# EAGLE design zigduino-mini-3 (EAGLE 5.10)
BOM: EXCLUDE; COLOR: GREEN; DNP: T; PARTNO: S-35390A-I8T1G
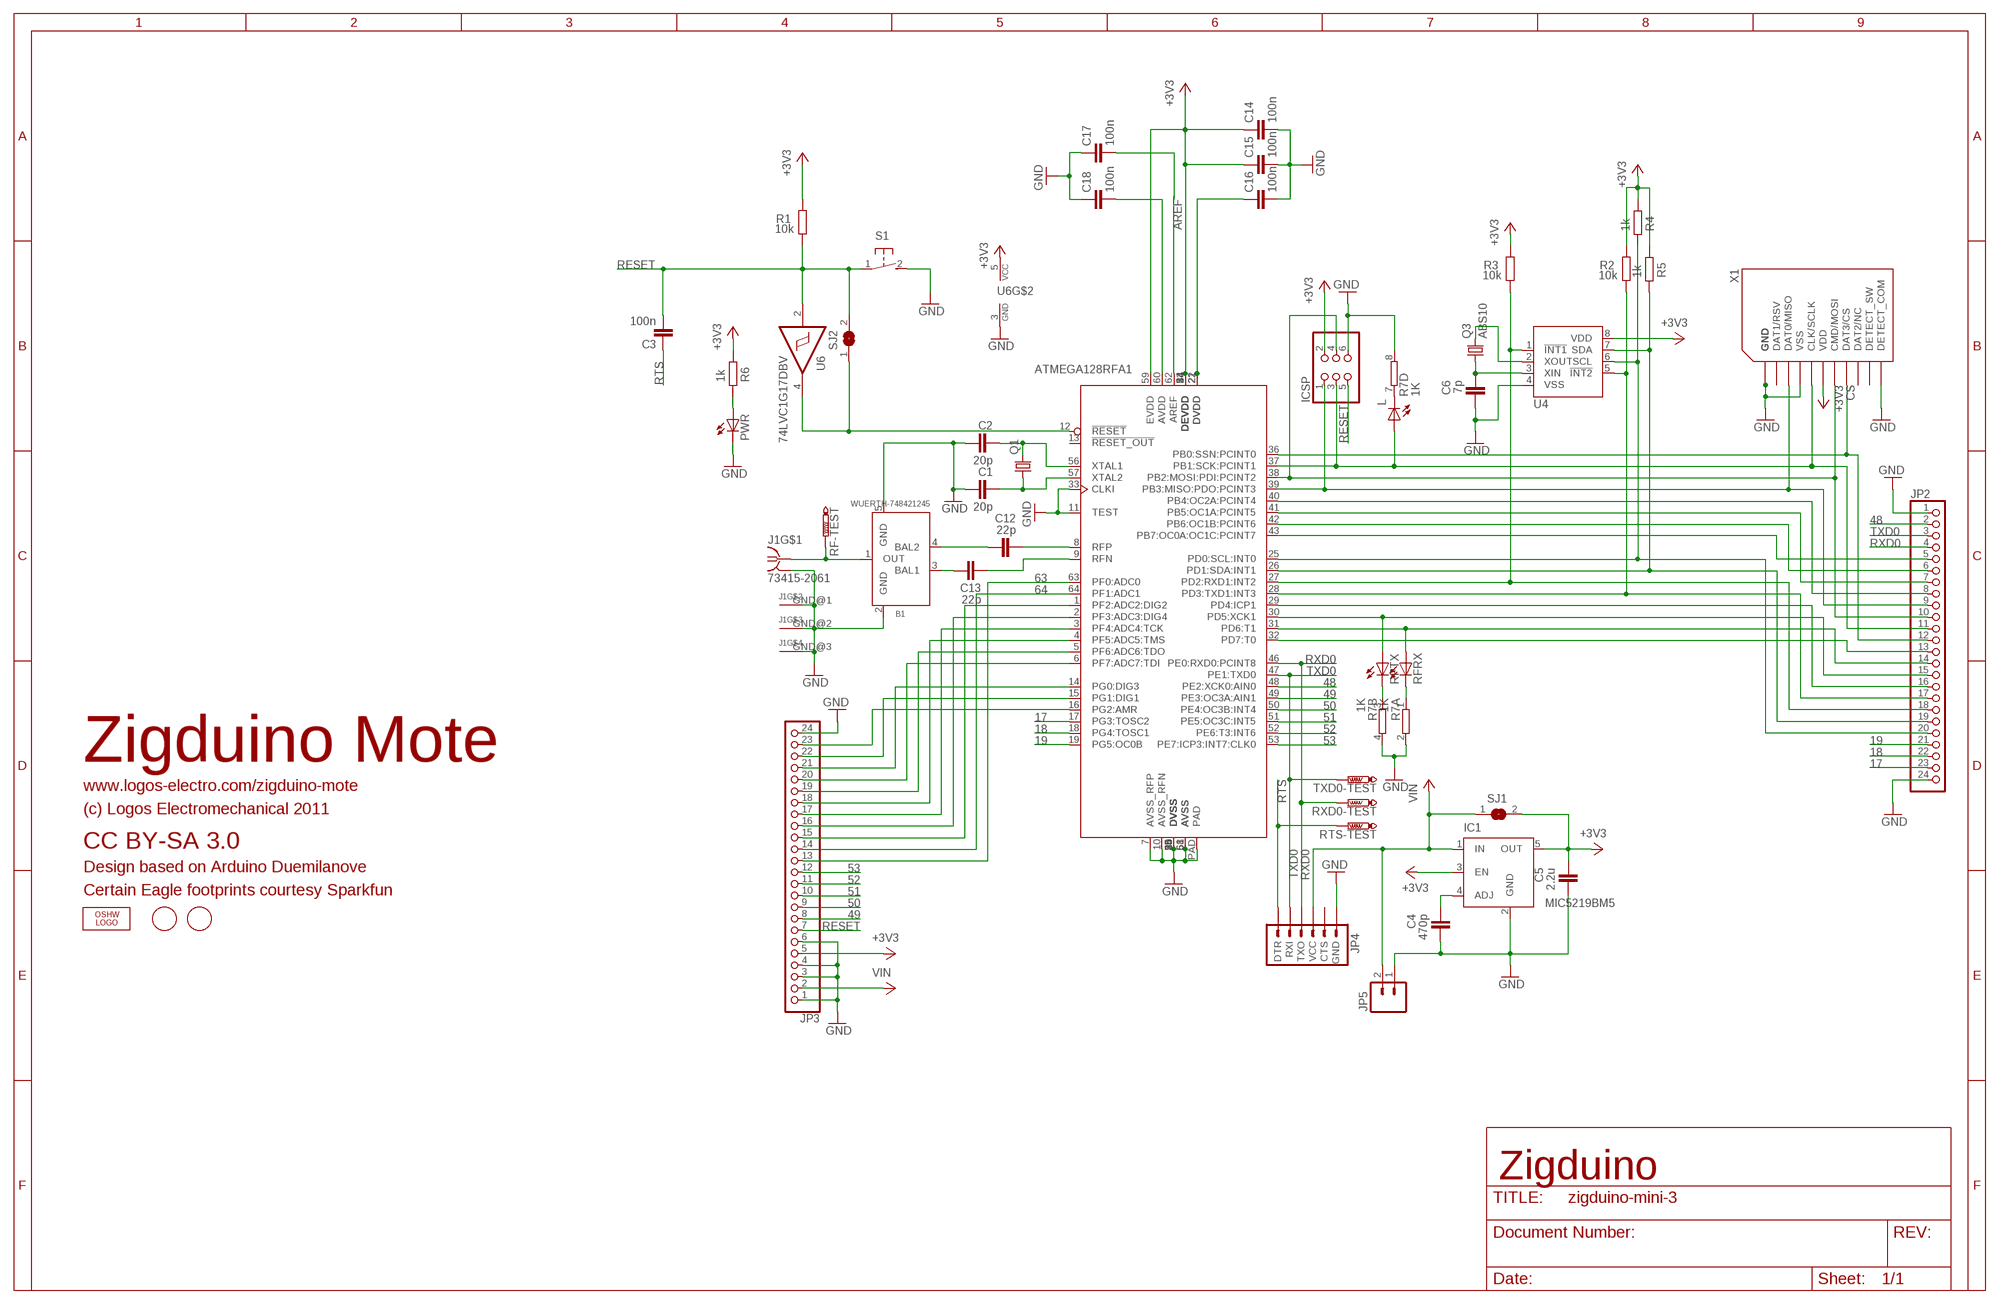
[diagram p0: schematic, sheet 1]

## Parts
B1  WUERTH-748421245  [WURTH-BALUN]
C1  20p  C-EUC0603  [C0603]
C2  20p  C-EUC0603  [C0603]
C3  100n  C-EUC0603  [C0603]
C4  470p  C-EUC0603  [C0603]
C5  2.2u  C-EUC0603  [C0603]
C6  7p  C-EUC0603  [C0603]
C12  22p  C-EUC0603  [C0603]
C13  22p  C-EUC0603  [C0603]
C14  100n  C-EUC0603  [C0603]
C15  100n  C-EUC0603  [C0603]
C16  100n  C-EUC0603  [C0603]
C17  100n  C-EUC0603  [C0603]
C18  100n  C-EUC0603  [C0603]
IC1  MIC5219BM5  [SOT23-5]
ICSP  PINHD-2X3_2.54-SMD  [2X03SMD]
J1  73415-2061  [MMCX]
JP2  PINHD-1X24  [1X24]
JP3  PINHD-1X24  [1X24]
JP4  ARDUINO_SERIAL_PROGRAMSMD  [1X06-SMD]
JP5  M02-JST-2MM-SMT  [S2B-PH]
L  LEDCHIP-LED0603  [CHIP-LED0603]
LOGO1  OSHW_LOGO_FILLX0200-NT  [OSHW_FILLX200_NOTEXT]
PWR  LEDCHIP-LED0603  [CHIP-LED0603]
Q1  CRYSTALCSM-3X  [CSM-3X]
Q3  ABS10  [ABS10]
R1  10k  R-EU_R0603  [R0603]
R2  10k  R-EU_R0603  [R0603]
R3  10k  R-EU_R0603  [R0603]
R4  1k  R-EU_R0603  [R0603]
R5  1k  R-EU_R0603  [R0603]
R6  1k  R-EU_R0603  [R0603]
R7  1K  4R-NCTS742C083  [CTS742C083-RES]
RF-TEST  PTR1TP13SQ  [TP13SQ]
RFRX  LEDCHIP-LED0603  [CHIP-LED0603]
RFTX  LEDCHIP-LED0603  [CHIP-LED0603]
RTS-TEST  PTR1TP13SQ  [TP13SQ]
RXD0-TEST  PTR1TP13SQ  [TP13SQ]
S1  B3U-1000  [B3U]
SJ1  SJ  [SJ]
SJ2  SJ  [SJ]
TXD0-TEST  PTR1TP13SQ  [TP13SQ]
U3  ATMEGA128RFA1  [QFN64]
U4  S35390A-I8T1  [SNT-8A]
U6  74LVC1G17DBV  [SOT23-5]
U$1  FIDUCIAL  [FIDUCIAL_1MM]
U$2  FIDUCIAL  [FIDUCIAL_1MM]
X1  MICROSD-MOLEX-502570  [MOLEX-MICRO-SD-502570]

## Nets
17: JP2.23 U3.17(PG3:TOSC2)
18: JP2.22 U3.18(PG4:TOSC1)
19: JP2.21 U3.19(PG5:OC0B)
48: JP2.2 U3.48(PE2:XCK0:AIN0)
49: JP3.8 U3.49(PE3:OC3A:AIN1)
50: JP3.9 U3.50(PE4:OC3B:INT4)
51: JP3.10 U3.51(PE5:OC3C:INT5)
52: JP3.11 U3.52(PE6:T3:INT6)
53: JP3.12 U3.53(PE7:ICP3:INT7:CLK0)
63: JP3.13 U3.63(PF0:ADC0)
64: JP3.14 U3.64(PF1:ADC1)
+3V3: C5.2 C14.1 C15.1 IC1.3(EN) IC1.5(OUT) ICSP.2 JP3.5 R1.2 R2.2 R3.2 R4.1 R5.1 R6.1 SJ1.2 U3.23(DEVDD) U3.34(DEVDD) U3.44(DEVDD) U3.54(DEVDD) U3.59(EVDD) U4.8(VDD) U6.5(VCC) X1.4(VDD)
+5V: IC1.1(IN) JP3.2 JP4.4(VCC) JP5.2 SJ1.1 ; supply symbol labelled VIN
AREF [aref]: C17.2 U3.62(AREF)
CS: JP2.12 U3.36(PB0:SSN:PCINT0) X1.2(DAT3/CS)
GND [gnd]: B1.2(GND) B1.5(GND) C1.1 C2.1 C4.1 C5.1 C6.1 C14.2 C15.2 C16.2 C17.1 C18.1 IC1.2(GND) ICSP.6 J1.GND@0(GND) J1.GND@1(PIN) J1.GND@2(PIN) J1.GND@3(PIN) JP2.1 JP2.24 JP3.1 JP3.3 JP3.4 JP3.6 JP3.24 JP4.6(GND) JP5.1 PWR.C R7.2 R7.4 R7.8 S1.2 U3.7(AVSS_RFP) U3.10(AVSS_RFN) U3.11(TEST) U3.20(DVSS) U3.24(DVSS) U3.33(CLKI) U3.35(DVSS) U3.45(DVSS) U3.55(DVSS) U3.58(AVSS) U3.61(AVSS) U3.PAD U4.4(VSS) U6.3(GND) X1.6(VSS) X1.DETECT_GND(DETECT_COM) X1.GND@0(GND) X1.GND@1(GND) X1.GND@2(GND) X1.GND@3(GND)
MISO: ICSP.1 JP2.9 U3.39(PB3:MISO:PDO:PCINT3) X1.7(DAT0/MISO)
MOSI: ICSP.4 JP2.10 U3.38(PB2:MOSI:PDI:PCINT2) X1.3(CMD/MOSI)
N$1: C4.2 IC1.4(ADJ)
N$2: L.C R7.7
N$3: PWR.A R6.2
N$4 [rf]: B1.4(BAL2) C12.1
N$6: C1.2 Q1.1 U3.57(XTAL2)
N$7: C2.2 Q1.2 U3.56(XTAL1)
N$8: JP2.8 U3.40(PB4:OC2A:PCINT4)
N$9 [rf]: B1.3(BAL1) C13.1
N$10: JP2.7 U3.41(PB5:OC1A:PCINT5)
N$11: JP2.6 U3.42(PB6:OC1B:PCINT6)
N$12: JP2.5 U3.43(PB7:OC0A:OC1C:PCINT7)
N$13: JP2.20 R4.2 U3.25(PD0:SCL:INT0) U4.6(SCL)
N$14: JP2.19 R5.2 U3.26(PD1:SDA:INT1) U4.7(SDA)
N$15: JP2.18 R3.1 U3.27(PD2:RXD1:INT2) U4.1(!INT1!)
N$16: JP2.17 R2.1 U3.28(PD3:TXD1:INT3) U4.5(!INT2!)
N$17: JP2.16 U3.29(PD4:ICP1)
N$18 [gnd]: B1.1(OUT) J1.C RF-TEST.TP
N$19: JP2.15 RFTX.A U3.30(PD5:XCK1)
N$20: JP2.14 RFRX.A U3.31(PD6:T1)
N$21: JP2.13 U3.32(PD7:T0)
N$22: JP3.23 U3.16(PG2:AMR)
N$23 [rf]: C12.2 U3.8(RFP)
N$24 [rf]: C13.2 U3.9(RFN)
N$25: JP3.22 U3.15(PG1:DIG1)
N$26: JP3.21 U3.14(PG0:DIG3)
N$27: JP3.20 U3.6(PF7:ADC7:TDI)
N$28: JP3.19 U3.5(PF6:ADC6:TDO)
N$29: SJ2.1 U3.12(!RESET!) U6.4(O)
N$30: JP3.18 U3.4(PF5:ADC5:TMS)
N$31: JP3.17 U3.3(PF4:ADC4:TCK)
N$32: JP3.16 U3.2(PF3:ADC3:DIG4)
N$33: JP3.15 U3.1(PF2:ADC2:DIG2)
N$34: R7.3 RFTX.C
N$35: R7.1 RFRX.C
N$36: C6.2 Q3.1 U4.3(XIN)
N$37: Q3.2 U4.2(XOUT)
N$63: C16.1 U3.21(DVDD) U3.22(DVDD)
N$64: C18.2 U3.60(AVDD)
RESET: C3.2 ICSP.5 JP3.7 R1.1 S1.1 SJ2.2 U6.2(I)
RTS: C3.1 JP4.1(DTR) RTS-TEST.TP
RXD0: JP2.4 JP4.3(TXO) RXD0-TEST.TP U3.46(PE0:RXD0:PCINT8)
SCK: ICSP.3 JP2.11 L.A U3.37(PB1:SCK:PCINT1) X1.5(CLK/SCLK)
TXD0: JP2.3 JP4.2(RXI) TXD0-TEST.TP U3.47(PE1:TXD0)
Unconnected: JP4.5(CTS) R7.5 R7.6 U3.13(!RESET_OUT!) X1.1(DAT2/NC) X1.8(DAT1/RSV) X1.DETECT_SW

## Notes on the sheet
- ATMEGA128RFA1
- Zigduino Mote
- www.logos-electro.com/zigduino-mote
- (c) Logos Electromechanical 2011
- CC BY-SA 3.0
- Design based on Arduino Duemilanove
- Certain Eagle footprints courtesy Sparkfun
- Zigduino

## Library data of the parts
B1 = atmega128rfa1:WUERTH-748421245: Recommended Balun for Atmega128RFA1
C1-C6 C12-C18 = resistor:C-EU: CAPACITOR, European symbol
IC1 = v-reg-micrel:MIC5219BM5: VOLTAGE REGULATOR
ICSP = pinhead-1:PINHD-2X3: PIN HEADER
J1 = atmega128rfa1:73415-2061: Molex 73415-2061
JP2 JP3 = pinhead:PINHD-1X24: PIN HEADER
JP4 = SparkFun:ARDUINO_SERIAL_PROGRAM
JP5 = SparkFun:M02: Header 2 Standard 2-pin 0.1" header. Use with straight break away headers (SKU : PRT-00116), right angle break away headers (PRT-00553), swiss pins (PRT-00743), machine pins (PRT-00117), and female headers (PRT-00115). Molex polarized connector foot print use with SKU : PRT-08233 with associated crimp pins and housings.
L PWR RFRX RFTX = led:LED: LED OSRAM: - CHIPLED LG R971, LG N971, LY N971, LG Q971, LY Q971, LO R971, LY R971 LH N974, LH R974 LS Q976, LO Q976, LY Q976 LO Q996 - Hyper CHIPLED LW Q18S LB Q993, LB Q99A, LB R99A - SideLED LS A670, LO A670, LY A670, LG A670, LP A670 LB A673, LV A673, LT A673, LW A673 LH A674 LY A675 LS A676, LA A676, LO A676, LY A676, LW A676 LS A679, LY A679, LG A679 - Hyper Micro SIDELED® LS Y876, LA Y876, LO Y876, LY Y876 LT Y87S - SmartLED LW L88C, LW L88S LB L89C, LB L89S, LG L890 LS L89K, LO L89K, LY L89K LS L896, LA L896, LO L896, LY L896 - TOPLED LS T670, LO T670, LY T670, LG T670, LP T670 LSG T670, LSP T670, LSY T670, LOP T670, LYG T670 LG T671, LOG T671, LSG T671 LB T673, LV T673, LT T673, LW T673 LH T674 LS T676, LA T676, LO T676, LY T676, LB T676, LH T676, LSB T676, LW T676 LB T67C, LV T67C, LT T67C, LS T67K, LO T67K, LY T67K, LW E67C LS E67B, LA E67B, LO E67B, LY E67B, LB E67C, LV E67C, LT E67C LW T67C LS T679, LY T679, LG T679 LS T770, LO T770, LY T770, LG T770, LP T770 LB T773, LV T773, LT T773, LW T773 LH T774 LS E675, LA E675, LY E675, LS T675 LS T776, LA T776, LO T776, LY T776, LB T776 LHGB T686 LT T68C, LB T68C - Hyper Mini TOPLED® LB M676 - Mini TOPLED Santana® LG M470 LS M47K, LO M47K, LY M47K Source: http://www.osram.convergy.de LUXEON: - LUMILED® LXK2-PW12-R00, LXK2-PW12-S00, LXK2-PW14-U00, LXK2-PW14-V00 LXK2-PM12-R00, LXK2-PM12-S00, LXK2-PM14-U00 LXK2-PE12-Q00, LXK2-PE12-R00, LXK2-PE12-S00, LXK2-PE14-T00, LXK2-PE14-U00 LXK2-PB12-K00, LXK2-PB12-L00, LXK2-PB12-M00, LXK2-PB14-N00, LXK2-PB14-P00, LXK2-PB14-Q00 LXK2-PR12-L00, LXK2-PR12-M00, LXK2-PR14-Q00, LXK2-PR14-R00 LXK2-PD12-Q00, LXK2-PD12-R00, LXK2-PD12-S00 LXK2-PH12-R00, LXK2-PH12-S00 LXK2-PL12-P00, LXK2-PL12-Q00, LXK2-PL12-R00 Source: www.luxeon.com KINGBRIGHT: KA-3528ASYC Source: www.kingbright.com
LOGO1 = OSHW:OSHW_LOGO_FILL
Q1 = logos-crystals:CRYSTAL: CRYSTAL
Q3 = logos-crystals:ABS10
R1-R6 = resistor:R-EU_: RESISTOR, European symbol
R7 = res-cap-arrays:4R-N: Array Chip Resistor Source: RS Component / Phycomp
RF-TEST RTS-TEST RXD0-TEST TXD0-TEST = testpad:PTR1: TEST PIN
S1 = logos-faves:B3U-1000: Omron B3U-1000 SMD tact switch
SJ1 SJ2 = jumper:SJ: SMD solder JUMPER
U3 = atmega128rfa1:ATMEGA128RFA1: Atmega128RFA1 -- Atmega128 with Zigbee
U4 = logos-rtc:S35390A: S-35390A 2-Wire RTC
U6 = 74xx-little-us:74*1G17: Single Schmitt-Trigger Buffer
U$1 U$2 = adafruit:FIDUCIAL: For use by pick and place machines to calibrate the vision/machine, 1mm By microbuilder.eu
X1 = logos-faves:MICROSD-MOLEX-502570

## Net classes
1 power: width 0.254 mm, drill 0.381 mm
2 gnd: width 0.254 mm, drill 0.381 mm
3 usbvcc: width 0.305 mm, drill 0.381 mm
4 aref: width 0.305 mm
5 rf: width 0.254 mm

## Board
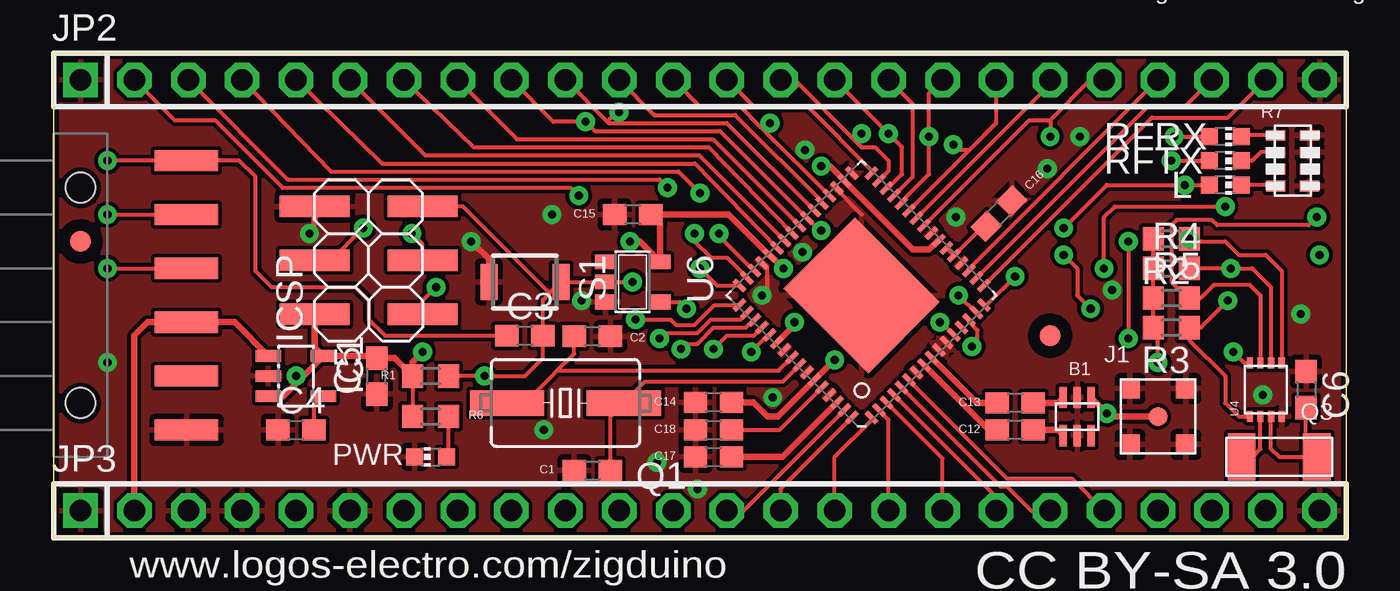
[diagram p1: board, top side]
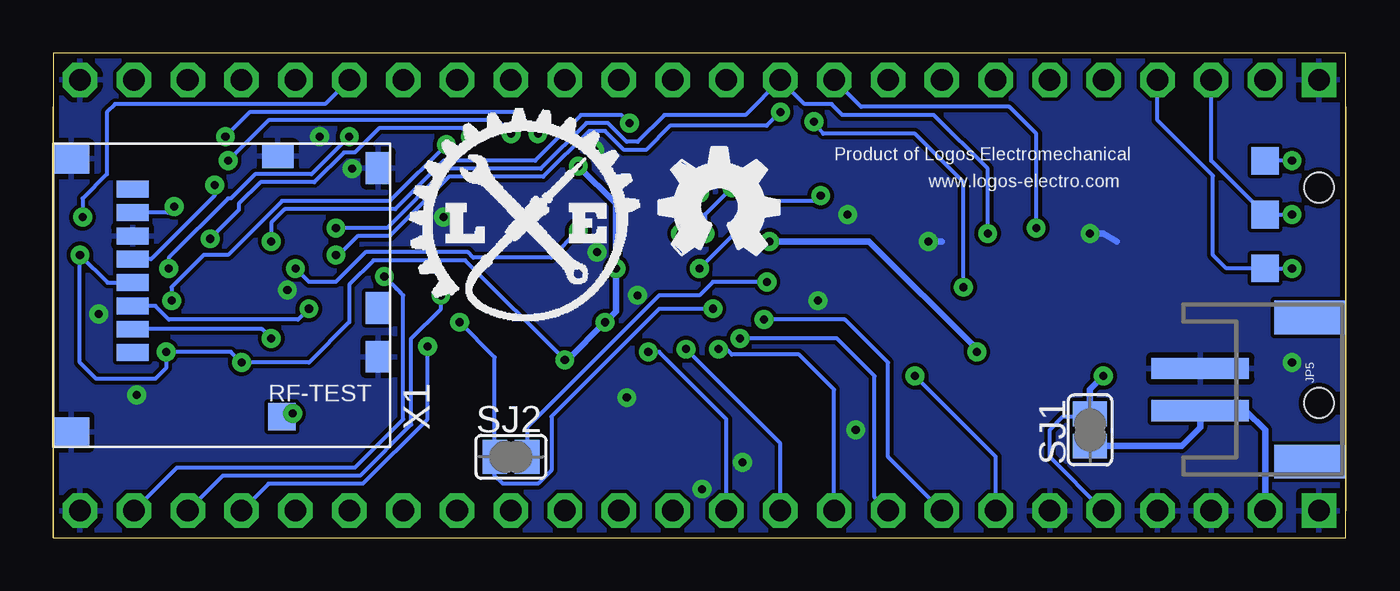
[diagram p2: board, bottom side, seen from below]

Size 60.96 x 22.86 mm. Coordinates in mm from the lower left corner, seen from the top.
Outline: 0,22.86 60.96,22.86 60.96,0 0,0 0,22.86
Copper layers (1*16): Top 0.0356mm / dielectric 1.5011mm / Bottom 0.0356mm
Design rules "hbl-panel-7mil *": minimum track width 7mil, minimum drill 15mil, track to track 7mil, track to pad 7mil, pad to pad 7mil, via to via 7mil, smd to smd 0mil, copper to edge 10mil, drill to drill 8mil, minimum pad ring 12mil, minimum via ring 10mil, stop-mask expansion 0mil, vias tented up to drill 50mil, thermal gap 10mil
Milling: 2 lines

### Footprints (pad centres in the part's own frame; a part is rotated, then mirrored left to right if it is on the bottom)
WURTH-BALUN = smd 0.35 x 1: 1 0.65,0.9; 2 0,0.9; 3 -0.65,0.9; 4 -0.65,-0.9; 5 0,-0.9; 6 0.65,-0.9
C0603 = smd 1.1 x 1: 1 -0.85,0; 2 0.85,0
SOT23-5 = smd 0.55 x 1.2: 1 -0.95,-1.3; 2 0,-1.3; 3 0.95,-1.3; 4 0.95,1.3; 5 -0.95,1.3
2X03SMD = smd 1.016 x 3.302: 1 -1.27,-3.81; 2 -1.27,1.27; 3 1.27,-3.81; 4 1.27,1.27; 5 3.81,-3.81; 6 3.81,1.27
MMCX = smd 0.89 x 0.89: C 0,0 | smd 0.94 x 0.94: GND@0 -1.32,1.32; GND@1 1.32,1.32; GND@2 -1.32,-1.32; GND@3 1.32,-1.32
1X24 = drill 1.016 square: 1 -29.21,0 | drill 1.016 octagon: 2 -26.67,0; 3 -24.13,0; 4 -21.59,0; 5 -19.05,0; 6 -16.51,0; 7 -13.97,0; 8 -11.43,0; 9 -8.89,0; 10 -6.35,0; 11 -3.81,0; 12 -1.27,0; 13 1.27,0; 14 3.81,0; 15 6.35,0; 16 8.89,0; 17 11.43,0; 18 13.97,0; 19 16.51,0; 20 19.05,0; 21 21.59,0; 22 24.13,0; 23 26.67,0; 24 29.21,0
1X06-SMD = smd 1 x 3: 1 -6.35,5; 2 -3.81,5; 3 -1.27,5; 4 1.27,5; 5 3.81,5; 6 6.35,5 | hole 1.4: -5.08,0; 5.08,0
S2B-PH = smd 1 x 4.6: 1 -1,-3.7; 2 1,-3.7 | smd 1.6 x 3.4: NC1 -3.4,1.5; NC2 3.4,1.5
CHIP-LED0603 = smd 0.8 x 0.8: A 0,-0.75; C 0,0.75
CSM-3X = smd 3.5 x 1.2: 1 -2.75,0; 2 2.75,0
ABS10 = smd 1.3 x 2.2: 1 1.775,0; 2 -1.775,0
R0603 = smd 1 x 1.1: 1 -0.85,0; 2 0.85,0
CTS742C083-RES = smd 0.9 x 0.5: 1 -0.8,1.2; 2 0.8,1.2; 3 -0.8,0.4; 4 0.8,0.4; 5 -0.8,-0.4; 6 0.8,-0.4; 7 -0.8,-1.2; 8 0.8,-1.2
TP13SQ = smd 1.3 x 1.3: TP 0,0
B3U = smd 0.8 x 1.7: 1 -1.7,0; 2 1.7,0
SJ = smd 1.168 x 1.6: 1 -0.762,0; 2 0.762,0
QFN64 = smd 0.7 x 0.25: 1 -4.4,3.75; 2 -4.4,3.25; 3 -4.4,2.75; 4 -4.4,2.25; 5 -4.4,1.75; 6 -4.4,1.25; 7 -4.4,0.75; 8 -4.4,0.25; 9 -4.4,-0.25; 10 -4.4,-0.75; 11 -4.4,-1.25; 12 -4.4,-1.75; 13 -4.4,-2.25; 14 -4.4,-2.75; 15 -4.4,-3.25; 16 -4.4,-3.75; 33 4.4,-3.75; 34 4.4,-3.25; 35 4.4,-2.75; 36 4.4,-2.25; 37 4.4,-1.75; 38 4.4,-1.25; 39 4.4,-0.75; 40 4.4,-0.25; 41 4.4,0.25; 42 4.4,0.75; 43 4.4,1.25; 44 4.4,1.75; 45 4.4,2.25; 46 4.4,2.75; 47 4.4,3.25; 48 4.4,3.75 | smd 0.25 x 0.7: 17 -3.75,-4.4; 18 -3.25,-4.4; 19 -2.75,-4.4; 20 -2.25,-4.4; 21 -1.75,-4.4; 22 -1.25,-4.4; 23 -0.75,-4.4; 24 -0.25,-4.4; 25 0.25,-4.4; 26 0.75,-4.4; 27 1.25,-4.4; 28 1.75,-4.4; 29 2.25,-4.4; 30 2.75,-4.4; 31 3.25,-4.4; 32 3.75,-4.4; 49 3.75,4.4; 50 3.25,4.4; 51 2.75,4.4; 52 2.25,4.4; 53 1.75,4.4; 54 1.25,4.4; 55 0.75,4.4; 56 0.25,4.4; 57 -0.25,4.4; 58 -0.75,4.4; 59 -1.25,4.4; 60 -1.75,4.4; 61 -2.25,4.4; 62 -2.75,4.4; 63 -3.25,4.4; 64 -3.75,4.4 | smd 5.65 x 4.75: PAD 0,0
SNT-8A = smd 0.3 x 0.52: 1 -0.75,-1.265; 2 -0.25,-1.265; 3 0.25,-1.265; 4 0.75,-1.265; 5 0.75,1.265; 6 0.25,1.265; 7 -0.25,1.265; 8 -0.75,1.265
SOT23-5' = smd 0.69 x 0.99: 1 -0.95,-1.29; 2 0,-1.29; 3 0.95,-1.29; 4 0.95,1.3; 5 -0.95,1.3
FIDUCIAL_1MM = smd 1 x 1: 1 0,0
MOLEX-MICRO-SD-502570 = smd 0.8 x 1.5: 1 -2.7,-3.75; 2 -1.6,-3.75; 3 -0.5,-3.75; 4 0.6,-3.75; 5 1.7,-3.75; 6 2.8,-3.75; 7 3.9,-3.75; 8 5,-3.75 | smd 1.15 x 1.5: DETECT_GND 6.575,-10.6 | smd 1.5 x 1.15: DETECT_SW -0.6,-15.325; GND@2 6,-15.325; GND@3 -2.9,-15.325 | smd 1.4 x 1.7: GND@0 -6.45,-0.85; GND@1 6.45,-0.85

### Placement (x,y rotation side)
B1  48.26,5.71 0 top
C1  25.4,3.17 0 top
C2  25.4,9.5 180 top
C3  22.23,9.53 0 top
C4  11.43,5.08 0 top
C5  15.24,7.62 90 top
C6  59.05,6.99 270 top
C12  45.34,5.08 180 top
C13  45.34,6.35 180 top
C14  31.11,6.38 180 top
C15  27.3,15.24 180 top
C16  44.58,15.29 45 top
C17  31.11,3.81 0 top
C18  31.11,5.08 0 top
IC1  11.43,7.62 270 top
ICSP  13.59,11.81 90 top
J1  52.07,5.71 0 top
JP2  30.48,21.59 0 top
JP3  30.48,1.27 0 top
JP4  1.27,11.43 270 top
JP5  3.17,6.99 270 bottom
L  55.24,16.64 270 top
LOGO1  32.38,13.34 0 bottom
PWR  17.78,3.81 90 top
Q1  24.13,6.35 180 top
Q3  57.78,3.81 0 top
R1  17.78,7.62 180 top
R2  52.7,14.1 180 top
R3  52.7,9.91 180 top
R4  52.7,12.7 0 top
R5  52.7,11.3 0 top
R6  17.78,5.71 0 top
R7  58.42,17.78 0 top
RF-TEST  50.16,5.71 0 bottom
RFRX  55.24,18.92 270 top
RFTX  55.24,17.78 270 top
RTS-TEST  3.81,17.78 0 bottom
RXD0-TEST  3.81,12.7 0 bottom
S1  22.23,12.06 180 top
SJ1  12.06,5.08 90 bottom
SJ2  39.37,3.81 0 bottom
TXD0-TEST  3.81,15.24 0 bottom
U3  38.1,11.43 135 top
U4  57.15,6.99 0 top
U6  74LVC1G17DBV  [SOT23-5']  27.3,12.06 270 top
U$1  1.27,13.97 0 top
U$2  46.99,9.53 0 top
U$4  [LOGO-SM]  44.58,9.91 0 bottom
X1  60.96,11.43 90 bottom

### Tracks (layer width: path | path; a pad name or v marks a point on that pad's centre or on a via)
17
  Top 0.178: JP2.23 55.37,19.81 51.78,19.81 U3.17
18
  Top 0.178: JP2.22 53.34,20.32 51.59,20.32 U3.18
19
  Top 0.178: U3.19 43.16,12.68 JP2.21
48  (via drill 0.38)
  Top 0.178: U3.48 31.29,11.89 v30.48,12.7 | v24.77,16.13 24.38,16.51 10.79,16.51 7.62,19.68 5.71,19.68 JP2.2
  Bottom 0.178: v30.48,12.7 27.3,15.88 25.02,15.88 v24.77,16.13
49  (via drill 0.38)
  Top 0.178: U3.49 31.16,10.97 30.23,10.03 29.34,10.03 29.08,10.29 v27.43,10.29
  Bottom 0.178: v27.43,10.29 23.62,10.29 21.59,8.26 21.59,3.81 JP3.8
50  (via drill 0.38)
  Top 0.178: U3.50 32.69,10.59 32.38,10.29 30.99,10.29 30.35,9.65 28.83,9.65 v28.57,9.4
  Bottom 0.178: v28.57,9.4 24,9.4 22.23,7.62 22.23,1.91 JP3.9
51  (via drill 0.38)
  Top 0.178: U3.51 33,10.26 32.64,9.91 31.11,9.91 30.35,9.14 29.84,9.14 v29.59,8.89
  Bottom 0.178: v29.59,8.89 29.21,8.89 28.96,8.64 25.78,8.64 24.13,6.99 JP3.10
52  (via drill 0.38)
  Top 0.178: U3.52 33.02,9.53 31.75,9.53 v31.11,8.89
  Bottom 0.178: v31.11,8.89 26.67,4.45 JP3.11
53  (via drill 0.38)
  Top 0.178: U3.53 33.69,9.56 v32.89,8.76
  Bottom 0.178: v32.89,8.76 32.38,8.76 29.21,5.59 JP3.12
63
  Top 0.178: JP3.13 32.54,1.27 U3.63
64
  Top 0.178: JP3.14 34.29,2.32 U3.64
+3V3  (via drill 0.38)
  Top 0.178: 10.83,6.67 IC1.3 | v11.43,7.62 | v11.43,7.62 11.61,7.45 | 15.14,8.57 C5.2 | R1.2 R6.1 | v59.69,13.34 59.45,13.34 | U4.8 56.14,8.25 v55.63,8.76 | R2.2 R4.1 R5.1 R3.2 52.07,9.69 v52.07,8.26
  Top 0.305: 10.83,6.67 11.61,7.45 IC1.5 | IC1.5 15.14,8.57 | C5.2 16.08,8.47 R1.2 16.93,8.29 v17.4,8.76 | C14.1 32.99,6.38 33.66,5.71 34.15,5.71 U3.59 35.88,7.43 v36.83,8.38 | ICSP.2 12.32,8.98 IC1.5 | v27.18,13.97 27.65,13.97 U6.5 28.61,14.79 C15.1 31.82,15.24 U3.44 33.81,13.3 v34.42,12.7 | v36.2,17.53 36.6,17.53 U3.34 37.29,16.82 40.51,13.59 41.27,13.59 41.7,14.01 U3.23 | v34.92,10.16 34.92,10.02 U3.54
  Bottom 0.178: JP3.5 13.97,3.81 13.97,5.08 13.34,5.71 12.19,5.71 SJ1.2 | X1.4 58.38,12.03 v59.69,13.34 59.69,8.26 58.93,7.49 56.13,7.49 55.63,8 v55.63,8.76 52.58,8.76 v52.07,8.26 48.9,8.26 46.99,10.16 46.99,11.94 45.85,13.08 41.53,13.08 v36.83,8.38
  Bottom 0.305: SJ1.2 12.06,6.99 v11.43,7.62 | v17.4,8.76 17.4,8.89 22.48,13.97 v27.18,13.97 | v36.2,17.53 34.42,15.75 v34.42,12.7 34.42,10.67 v34.92,10.16 36.7,8.38 v36.83,8.38
+5V
  Top 0.305: IC1.1 8.54,10.16 JP4.4 4.45,10.16 3.81,9.53 JP3.2
  Bottom 0.178: 4.71,5.99 JP5.2
  Bottom 0.305: 4.71,5.99 3.81,5.08 JP3.2 | SJ1.1 7.75,4.32 6.88,5.19 JP5.2
AREF
  Top 0.305: C17.2 34.37,3.81 U3.62
CS  (via drill 0.38)
  Top 0.178: JP2.12 30.48,20.32 32.38,20.32 33.34,19.37 | U3.36 33.34,19.37 | v50.67,13.97 v50.67,9.4 | v33.78,19.56 33.53,19.56 33.34,19.37
  Bottom 0.178: v33.78,19.56 34.16,19.94 36.07,19.94 38.23,17.78 42.55,17.78 44.83,15.49 50.04,15.49 50.67,14.86 v50.67,13.97 | X1.2 51.1,9.83 v50.67,9.4
GND  (via drill 0.38)
  Top 0.178: U3.45 33.66,12.7 33.66,11.68 v33.4,11.43 | U3.35 36.93,16.41 38.1,15.24
  Top 0.305: ICSP.6 12.32,14.86 v12.06,14.35 | S1.2 20.52,13.13 v19.68,13.97 | U3.45
  Bottom 0.305: v12.06,14.35 11.43,14.35 10.79,13.97 | v19.68,13.97 19.05,13.97
  other vias: 23.5,15.24 2.54,8.26 35.43,18.29 23.11,5.08 28.45,3.56 42.55,15.11 46.86,17.4 48.39,18.92 35.31,13.46 49.91,11.68 30.35,2.29 33.91,6.6 24.89,11.18 58.8,10.54 57.02,6.73
  pour Top: 0,22.86 60.96,22.86 60.96,0 0,0
  pour Bottom: 60.96,22.86 0,22.86 0,0 60.96,0
MISO  (via drill 0.38)
  Top 0.178: U3.39 31.41,19.18 25.53,19.18 v25.08,19.62 23.56,19.62 JP2.9 | ICSP.1 17.4,11.18 v18.03,11.81 | v55.24,15.62 50.04,15.62 49.53,15.11 v49.53,12.7 | U3.39 35.52,15.03 | v36.2,14.48 36.11,14.48 U3.39
  Bottom 0.178: v18.03,11.81 18.03,16.76 20.32,19.05 24.64,19.05 v25.08,19.62 | X1.7 55.54,15.33 v55.24,15.62 | v36.2,14.48 37.47,13.21 41.15,13.21 41.4,13.46 46.23,13.46 47.62,12.06 48.9,12.06 v49.53,12.7
MOSI  (via drill 0.38)
  Top 0.178: JP2.10 26.1,19.62 | 26.1,19.62 26.16,19.56 31.74,19.56 U3.38 35.88,15.43 36.07,15.24 | ICSP.4 13.08,13.08 v14.61,14.61 | v48.9,10.79 48.26,11.43 48.26,12.7 v47.62,13.34 | v26.67,20.07 26.54,20.07 26.1,19.62
  Bottom 0.178: v14.61,14.61 14.61,19.05 15.88,20.32 22.86,20.32 JP2.10 | X1.3 56.14,10.93 55.5,10.29 49.4,10.29 v48.9,10.79 | v47.62,13.34 47.5,13.34 46.61,14.22 45.09,14.22 42.29,17.02 37.85,17.02 35.69,19.18 34.92,19.18 34.04,18.29 33.01,18.29 31.87,19.43 27.31,19.43 v26.67,20.07
N$1
  Top 0.178: C4.2 12.28,6.22 IC1.4
N$2
  Top 0.178: L.C 57.56,16.64 R7.7
N$3
  Top 0.178: R6.2 18.63,3.91 PWR.A
N$4
  Top 0.305: C12.1 47.34,5.08 B1.4
N$6
  Top 0.178: U3.57 34.39,7.37 27.9,7.37 Q1.1 26.25,5.72 C1.2
N$7
  Top 0.178: U3.56 34.19,7.87 23.75,7.87 | 23.75,7.87 23.5,7.62 22.23,6.35 Q1.2 | C2.2 24.55,8.68 23.75,7.87
N$8
  Top 0.178: JP2.8 21.84,18.8 31.09,18.8 U3.40
N$9
  Top 0.305: C13.1 47.34,6.35 B1.3
N$10
  Top 0.178: JP2.7 19.81,18.41 30.89,18.41 U3.41
N$11
  Top 0.178: JP2.6 17.53,18.03 30.43,18.03 U3.42
N$12
  Top 0.178: JP2.5 15.49,17.65 30.24,17.65 U3.43
N$13  (via drill 0.38)
  Top 0.178: JP2.20 48.9,21.59 46.99,19.68 | 46.99,19.68 46,19.68 U3.25 | 46.99,19.68 v46.99,18.92 | U4.6 57.4,11.81 56.52,12.7 v55.5,12.7 R4.2
  Bottom 0.178: v46.99,18.92 48.77,17.14 51.44,17.14 52.58,16 52.7,16 55.5,13.21 v55.5,12.7
N$14  (via drill 0.38)
  Top 0.178: JP2.19 46.99,21.38 U3.26 | U4.7 56.9,11.43 56.39,11.94 54.74,11.94 54.1,11.3 R5.2 53.34,11.43 52.7,12.06 52.7,14.73 52.96,14.99 54.61,14.99 54.86,14.73 59.18,14.73 59.44,14.99 v59.56,15.11
  Bottom 0.178: v59.56,15.11 59.56,16 58.42,17.14 58.42,20.07 58.04,20.45 48.13,20.45 JP2.19
N$15  (via drill 0.38)
  Top 0.178: 44.45,19.55 JP2.18 | U3.27 44.45,19.55 | 44.45,19.55 44.44,19.55 43.18,18.29 42.67,18.29 v42.42,18.54 | U4.1 55.88,5.72 55.24,6.35 55.24,7.62 53.55,9.31 R3.1 54.1,9.91 v55.37,11.18
  Bottom 0.178: v55.37,11.18 55.37,11.81 53.85,13.34 52.7,13.34 50.16,15.88 45.09,15.88 42.3,18.66 42.3,18.42 v42.42,18.54
N$16  (via drill 0.38)
  Top 0.178: U3.28 39.97,15.84 41.27,17.14 v41.27,18.92 41.27,20.95 JP2.17 | U4.5 57.9,12.59 57.15,13.34 55.88,13.34 55.24,13.97 54.1,13.97 R2.1
  Bottom 0.178: v41.27,18.92 41.66,19.3 45.59,19.3 46.74,18.16 47.24,18.16 48.64,16.76 51.18,16.76 52.2,15.75 52.2,15.46 R2.1
  other vias: 53.55,14.1
N$17
  Top 0.178: U3.29 40.51,17.02 40.51,20.45 JP2.16
N$18  (via drill 0.38)
  Top 0.305: J1.C 49.81,5.71 v49.67,5.86 49.35,6.17 B1.1
  Bottom 0.305: RF-TEST.TP 49.81,5.71 v49.67,5.86
N$19  (via drill 0.38)
  Top 0.178: JP2.15 v39.37,19.05 40.01,18.41 40.01,17.14 39.35,16.49 U3.30 | v52.7,17.78 RFTX.A
  Bottom 0.178: v52.7,17.78 50.8,19.68 40.01,19.68 v39.37,19.05
N$20  (via drill 0.38)
  Top 0.178: JP2.14 34.92,21.59 37.78,18.73 | 37.78,18.73 38.1,18.41 38.73,18.41 39.37,17.78 39.37,17.3 U3.31 | v52.83,18.92 RFRX.A | 37.78,18.73 v38.1,19.05
  Bottom 0.178: v52.83,18.92 51.69,20.07 39.12,20.07 v38.1,19.05
N$21
  Top 0.178: U3.32 38.56,17.32 35.56,20.32 33.02,20.32 JP2.13
N$22  (via drill 0.38)
  Top 0.178: U3.16 43.99,10.97 v45.34,12.32
  Bottom 0.178: JP3.23 55.12,3.3 46.74,3.3 44.45,5.59 44.45,11.43 44.58,11.56 44.77,11.75 v45.34,12.32
N$23
  Top 0.305: C12.2 44.1,5.08 U3.8
N$24
  Top 0.305: C13.2 43.53,6.35 U3.9
N$25  (via drill 0.38)
  Top 0.178: U3.15 43.48,10.62 v42.67,11.43
  Bottom 0.178: v42.67,11.43 42.67,10.79 44.07,9.4 44.07,5.33 46.48,2.92 52.96,2.92 JP3.22
N$26  (via drill 0.38)
  Top 0.178: U3.14 43.16,10.18 43.56,9.78 43.56,9.27 v43.31,9.02
  Bottom 0.178: JP3.21 50.8,2.54 46.35,2.54 43.31,5.59 v43.31,9.02
N$27
  Top 0.178: U3.6 44.96,2.79 48.01,2.79 JP3.20
N$28
  Top 0.178: JP3.19 46.1,1.27 44.96,2.41 44.64,2.41 U3.5
N$29  (via drill 0.38)
  Top 0.178: U6.4 29.52,11.12 v29.84,10.79 | v41.78,10.16 41.84,10.16 U3.12
  Bottom 0.178: v29.84,10.79 32.38,10.79 37.47,5.71 37.47,3.17 38.1,2.54 39.75,2.54 40.13,2.92 SJ2.1 40.13,8.51 v41.78,10.16
N$30
  Top 0.178: U3.4 44.45,1.91 JP3.18
N$31
  Top 0.178: JP3.17 41.91,3.73 U3.3
N$32
  Top 0.178: JP3.16 39.37,5.56 U3.2
N$33
  Top 0.178: U3.1 38.56,5.54 36.83,3.81 JP3.15
N$34
  Top 0.178: RFTX.C 56.52,17.78 56.91,18.18 R7.3
N$35
  Top 0.178: R7.1 56.05,18.98 RFRX.C
N$36
  Top 0.178: C6.2 59.03,6.12 59.03,4.33 Q3.1 57.78,3.81 57.4,4.2 U4.3
N$37
  Top 0.178: U4.2 56.9,4.17 56.53,3.81 Q3.2
N$63
  Top 0.178: U3.22 | U3.22 U3.21 43.71,14.56 C16.1
N$64
  Top 0.178: C18.2 34.23,5.08 U3.60
RESET  (via drill 0.38)
  Top 0.178: 23.39,11.53 23.07,11.21 C3.2 23.07,8.47 22.23,7.62 v20.32,7.62 R1.1 | 23.39,11.53 S1.1 U6.2 v27.3,12.06 | ICSP.5 19.3,15.62 23.39,11.53
  Bottom 0.178: JP3.7 16.51,3.81 v20.32,7.62 | v27.3,12.06 29.84,12.06 30.48,11.43 32.38,11.43 38.61,5.21 SJ2.2
RTS  (via drill 0.38)
  Top 0.178: v2.54,17.78 JP4.1 8.76,17.78 9.53,17.02 9.53,12.57 10.29,11.81 14.22,11.81 14.86,11.18 14.86,10.29 15.62,9.53 C3.1
  Bottom 0.178: v2.54,17.78 RTS-TEST.TP
RXD0  (via drill 0.38)
  Top 0.178: v2.54,12.7 JP4.3 | U3.46 33,12.6 31.37,14.22 v31.37,14.35 | v30.48,16.26 29.46,17.27 13.08,17.27 JP2.4
  Bottom 0.178: v2.54,12.7 RXD0-TEST.TP 5.63,12.7 6.27,13.34 6.27,17.07 8.89,19.68 JP2.4 | v31.37,14.35 31.37,15.37 v30.48,16.26
SCK  (via drill 0.38)
  Top 0.178: U3.37 36.23,15.84 32.13,19.94 28.32,19.94 JP2.11 | L.A v53.34,16.64 49.66,16.64 v47.62,14.61 | ICSP.3 17.4,13.84 v16.89,14.35
  Bottom 0.178: v16.89,14.35 16.89,17.4 19.43,19.94 23.75,19.94 24.26,20.45 25.53,20.45 JP2.11 28.32,19.94 32.13,19.94 33.4,18.67 33.91,18.67 34.8,19.56 35.81,19.56 37.97,17.4 42.42,17.4 45.21,14.61 v47.62,14.61 | X1.5 56.34,13.13 53.34,16.13 v53.34,16.64
TXD0  (via drill 0.38)
  Top 0.178: v2.54,15.24 JP4.2 | U3.47 32.69,12.27 31.75,13.21 30.99,13.21 30.23,13.97 v30.23,14.35 | v28.96,16.51 28.57,16.89 11.05,16.89 JP2.3
  Bottom 0.178: JP2.3 6.35,17.78 TXD0-TEST.TP v2.54,15.24 | v30.23,14.35 30.23,15.24 v28.96,16.51

### Text on the board
tNames: Zigduino Mote | www.logos-electro.com/zigduino | www.logos-electro.com/zigduino | CC BY-SA 3.0
bNames: Product of Logos Electromechanical | www.logos-electro.com
Reference: C8 | R7 | R5 | R6 | R4 | C3 | C2 | R9 | R8 | R1 | R2 | C1 | C4 | C5 | X2 | C7 | C6